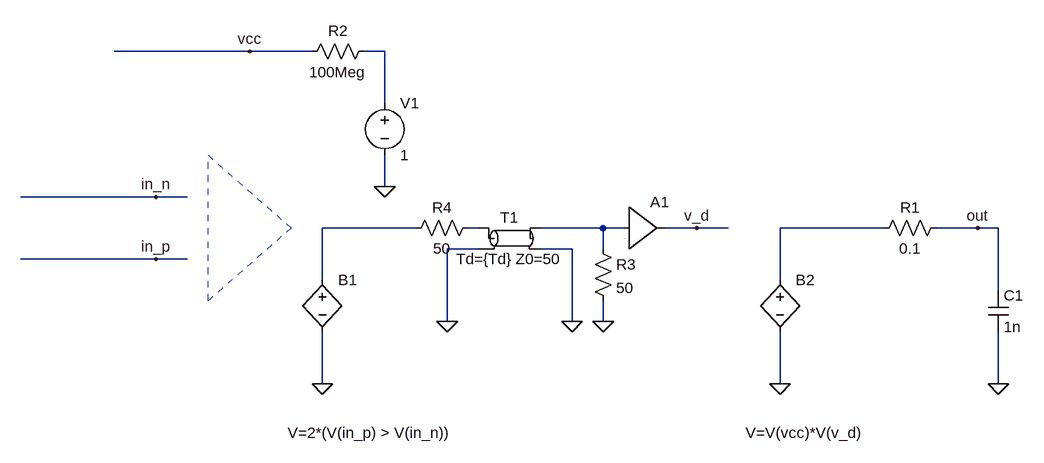
[diagram p0: schematic ideal_comparator_delay.asc]
ideal_comparator_delay.asc, the LTspice schematic file:
Version 4
SHEET 1 1880 680
WIRE 64 -208 -144 -208
WIRE 160 -208 64 -208
WIRE 272 -208 240 -208
WIRE 272 -128 272 -208
WIRE 272 0 272 -48
WIRE -80 16 -288 16
WIRE -32 16 -80 16
WIRE 320 64 176 64
WIRE 416 64 400 64
WIRE 608 64 512 64
WIRE 640 64 608 64
WIRE 752 64 704 64
WIRE 800 64 752 64
WIRE 1040 64 880 64
WIRE 1184 64 1120 64
WIRE 1216 64 1184 64
WIRE 416 96 368 96
WIRE 560 96 512 96
WIRE 608 96 608 64
WIRE -80 112 -288 112
WIRE -32 112 -80 112
WIRE 176 144 176 64
WIRE 880 144 880 64
WIRE 1216 160 1216 64
WIRE 368 208 368 96
WIRE 560 208 560 96
WIRE 608 208 608 176
WIRE 176 304 176 224
WIRE 880 304 880 224
WIRE 1216 304 1216 224
FLAG -80 112 in_p
FLAG -80 16 in_n
FLAG 176 304 0
FLAG 1184 64 out
FLAG 64 -208 vcc
FLAG 1216 304 0
FLAG 272 0 0
FLAG 560 208 0
FLAG 368 208 0
FLAG 608 208 0
FLAG 752 64 v_d
FLAG 880 304 0
SYMBOL bv 176 128 R0
WINDOW 3 -53 251 Left 2
SYMATTR Value V=2*(V(in_p) > V(in_n))
SYMATTR InstName B1
SYMBOL res 1136 48 R90
WINDOW 0 0 56 VBottom 2
WINDOW 3 32 56 VTop 2
SYMATTR InstName R1
SYMATTR Value 0.1
SYMBOL cap 1200 160 R0
SYMATTR InstName C1
SYMATTR Value 1n
SYMBOL voltage 272 -144 R0
SYMATTR InstName V1
SYMATTR Value 1
SYMBOL res 256 -224 R90
WINDOW 0 0 56 VBottom 2
WINDOW 3 32 56 VTop 2
SYMATTR InstName R2
SYMATTR Value 100Meg
SYMBOL Digital\\buf1 640 0 R0
SYMATTR InstName A1
SYMBOL res 592 80 R0
SYMATTR InstName R3
SYMATTR Value 50
SYMBOL tline 464 80 R0
SYMATTR InstName T1
SYMATTR Value Td={Td} Z0=50
SYMBOL res 416 48 R90
WINDOW 0 0 56 VBottom 2
WINDOW 3 32 56 VTop 2
SYMATTR InstName R4
SYMATTR Value 50
SYMBOL bv 880 128 R0
WINDOW 3 -53 251 Left 2
SYMATTR Value V=V(vcc)*V(v_d)
SYMATTR InstName B2
LINE Normal 0 176 0 -48 2
LINE Normal 128 64 0 176 2
LINE Normal 0 -48 128 64 2
LINE Normal 0 -48 0 -48 2

The netlist it stands for:
* ideal_comparator_delay.asc
B1 N002 0 V=2*(V(in_p) > V(in_n))
R1 out N005 0.1
C1 out 0 1n
V1 N001 0 1
R2 N001 vcc 100Meg
A1 N004 0 0 0 0 0 v_d 0 BUF
R3 N004 0 50
T1 N003 0 N004 0 Td={Td} Z0=50
R4 N003 N002 50
B2 N005 0 V=V(vcc)*V(v_d)
.backanno
.end